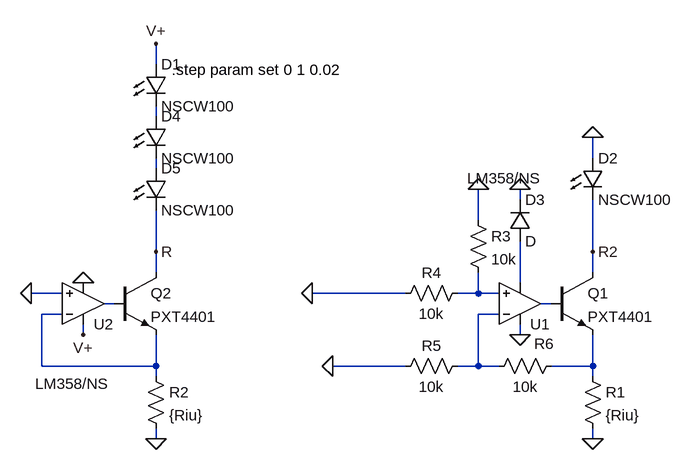
[diagram p0: schematic Draft14.asc]
Draft14.asc, the LTspice schematic file:
Version 4
SHEET 1 880 680
WIRE -560 -448 -560 -480
WIRE -560 -368 -560 -384
WIRE 112 -304 112 -336
WIRE -560 -288 -560 -304
WIRE 0 -240 0 -256
WIRE -64 -208 -64 -256
WIRE -560 -160 -560 -224
WIRE 112 -160 112 -240
WIRE -560 -128 -560 -160
WIRE 112 -128 112 -160
WIRE 0 -112 0 -176
WIRE -704 -96 -752 -96
WIRE -176 -96 -320 -96
WIRE -64 -96 -64 -128
WIRE -64 -96 -96 -96
WIRE -32 -96 -64 -96
WIRE -624 -80 -640 -80
WIRE 48 -80 32 -80
WIRE -704 -64 -736 -64
WIRE -32 -64 -64 -64
WIRE -672 -32 -672 -48
WIRE 0 -32 0 -48
WIRE -736 16 -736 -64
WIRE -560 16 -560 -32
WIRE -560 16 -736 16
WIRE -176 16 -288 16
WIRE -64 16 -64 -64
WIRE -64 16 -96 16
WIRE -32 16 -64 16
WIRE 112 16 112 -32
WIRE 112 16 48 16
WIRE -560 32 -560 16
WIRE 112 32 112 16
WIRE -560 128 -560 112
WIRE 112 128 112 112
FLAG 112 128 0
FLAG 0 -256 0
FLAG 112 -160 R2
FLAG -560 128 0
FLAG -672 -112 0
FLAG -672 -32 V+
FLAG -560 -160 R
FLAG -64 -256 0
FLAG -288 16 0
FLAG -560 -480 V+
FLAG -752 -96 0
FLAG 112 -336 0
FLAG -320 -96 0
FLAG 0 -32 0
SYMBOL EIT_Semiconductors\\npn 48 -128 R0
SYMATTR InstName Q1
SYMATTR Value PXT4401
SYMBOL res 96 16 R0
SYMATTR InstName R1
SYMATTR Value {Riu}
SYMBOL EXTRA\\ExtraOpamps\\LM358_NS 0 -80 M180
WINDOW 3 -81 193 Left 2
SYMATTR InstName U1
SYMBOL EIT_Semiconductors\\npn -624 -128 R0
SYMATTR InstName Q2
SYMATTR Value PXT4401
SYMBOL res -576 16 R0
SYMATTR InstName R2
SYMATTR Value {Riu}
SYMBOL EXTRA\\ExtraOpamps\\LM358_NS -672 -80 M180
WINDOW 3 -74 -123 Left 2
SYMATTR InstName U2
SYMBOL LED -576 -448 R0
SYMATTR InstName D1
SYMATTR Value NSCW100
SYMATTR Description Diode
SYMATTR Type diode
SYMBOL LED 96 -304 R0
SYMATTR InstName D2
SYMATTR Value NSCW100
SYMATTR Description Diode
SYMATTR Type diode
SYMBOL diode -16 -176 M180
WINDOW 0 24 64 Left 2
WINDOW 3 24 0 Left 2
SYMATTR InstName D3
SYMBOL res -80 -224 R0
SYMATTR InstName R3
SYMATTR Value 10k
SYMBOL res -80 -112 R90
WINDOW 0 0 56 VBottom 2
WINDOW 3 32 56 VTop 2
SYMATTR InstName R4
SYMATTR Value 10k
SYMBOL res -80 0 R90
WINDOW 0 0 56 VBottom 2
WINDOW 3 32 56 VTop 2
SYMATTR InstName R5
SYMATTR Value 10k
SYMBOL res 64 0 R90
WINDOW 0 -3 27 VBottom 2
WINDOW 3 32 56 VTop 2
SYMATTR InstName R6
SYMATTR Value 10k
SYMBOL LED -576 -368 R0
SYMATTR InstName D4
SYMATTR Value NSCW100
SYMATTR Description Diode
SYMATTR Type diode
SYMBOL LED -576 -288 R0
SYMATTR InstName D5
SYMATTR Value NSCW100
SYMATTR Description Diode
SYMATTR Type diode
TEXT -536 -440 Left 2 !.step param set 0 1 0.02

The netlist it stands for:
* Draft14.asc
Q1 R2 N006 N009 0 PXT4401
R1 N009 0 {Riu}
XU1 N004 N008 0 N003 N006 LM358/NS  ; pins In+ In- V+ V- OUT
Q2 R N005 N007 0 PXT4401
R2 N007 0 {Riu}
XU2 0 N007 V+ 0 N005 LM358/NS  ; pins In+ In- V+ V- OUT
D1 V+ N001 NSCW100
D2 0 R2 NSCW100
D3 N003 0 D
R3 0 N004 10k
R4 N004 0 10k
R5 N008 0 10k
R6 N009 N008 10k
D4 N001 N002 NSCW100
D5 N002 R NSCW100
.model D D
.lib standard.dio
.model NPN NPN
.model PNP PNP
.lib standard.bjt
.step param set 0 1 0.02
.backanno
.end